# Altium schematic sheet bme_rfm95.SchDoc
size A4
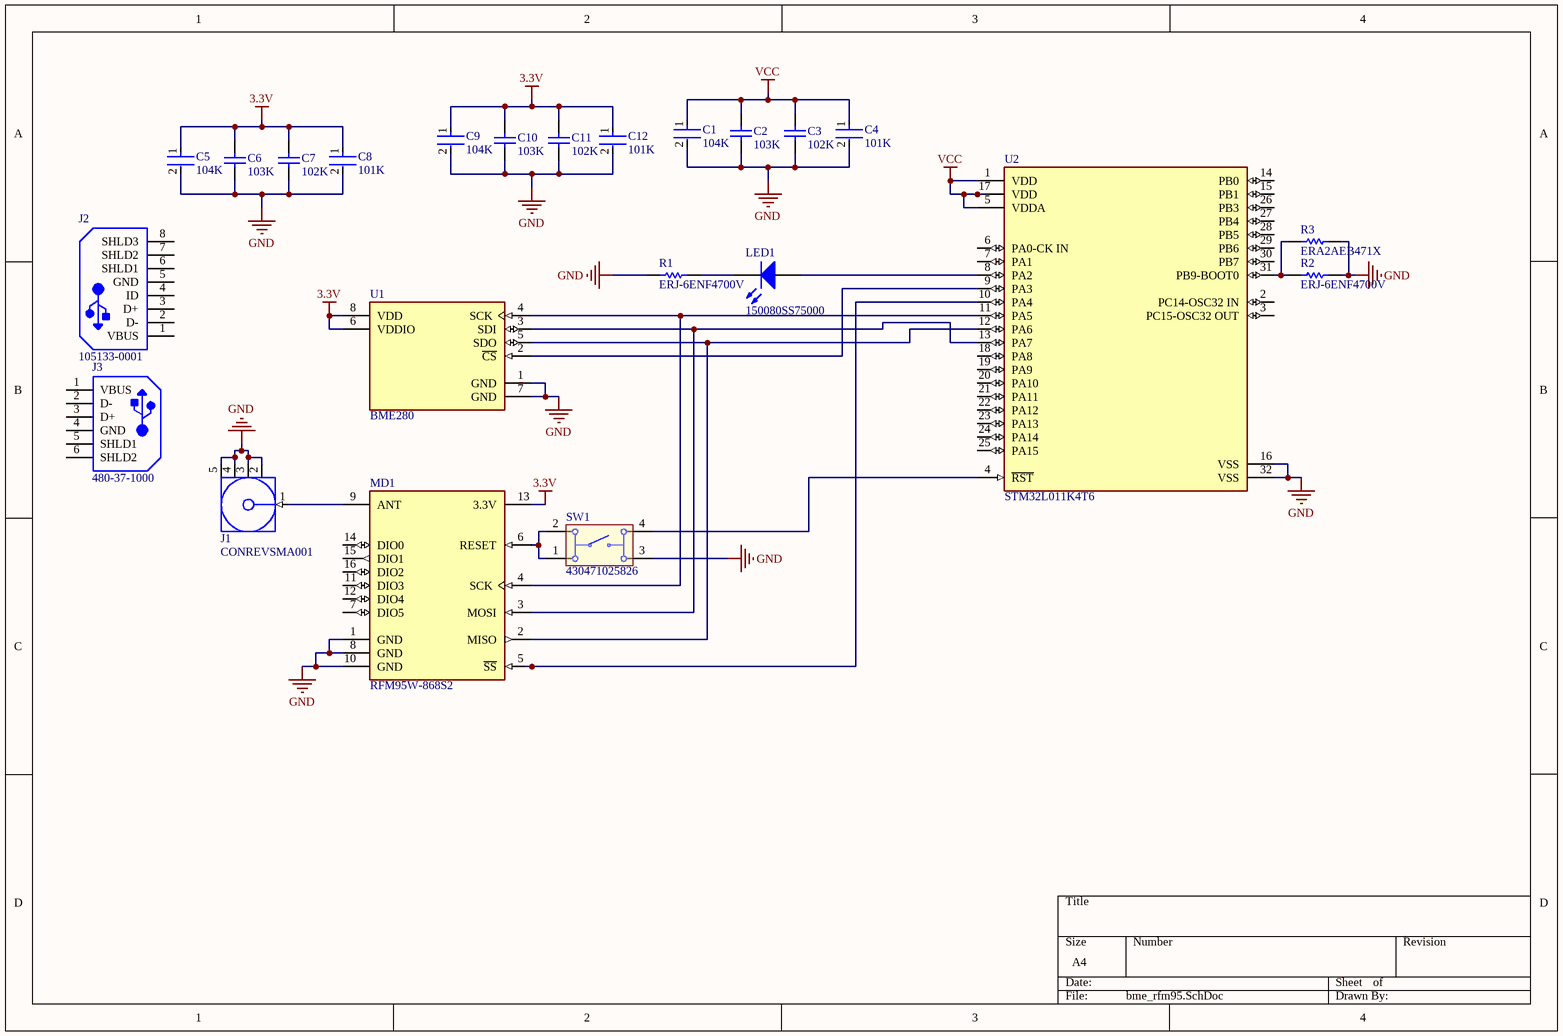
[diagram p0: bme_rfm95.SchDoc]

## Parts
C1  104K  [FP-C0805C-DN-MFG]
C2  103K  [CAPC2013X100X50NL20T25]
C3  102K  [CAPC2013X100X50LL20T25]
C4  101K  [FP-C0805C-DN-MFG]
C5  104K  [FP-C0805C-DN-MFG]
C6  103K  [CAPC2013X100X50NL20T25]
C7  102K  [CAPC2013X100X50LL20T25]
C8  101K  [FP-C0805C-DN-MFG]
C9  104K  [FP-C0805C-DN-MFG]
C10  103K  [CAPC2013X100X50NL20T25]
C11  102K  [CAPC2013X100X50LL20T25]
C12  101K  [FP-C0805C-DN-MFG]
J1  CONREVSMA001  [CON-REVSMA]
J2  105133-0001  [MOLX-105133-0001_V]
J3  480-37-1000  [MOLX-480-37-1000_V]
LED1  150080SS75000  [0805_A]
MD1  RFM95W-868S2  [FP-RFM95W-868S2-MFG]
R1  ERJ-6ENF4700V  [RESC2013X70X40LL20T20]
R2  ERJ-6ENF4700V  [RESC2013X70X40LL20T20]
R3  ERA2AEB471X  [RESC1005X40X25ML10T10]
SW1  430471025826  [430471025826]
U1  BME280  [FP-BME280-MFG]
U2  STM32L011K4T6  [FP-LQFP32-5V-MFG]

## Nets
3.3V: C5.1 C6.2 C7.2 C8.1 C9.1 C10.2 C11.2 C12.1 MD1.13(3.3V) U1.6(VDDIO) U1.8(VDD)
GND: C1.2 C2.1 C3.1 C4.2 C5.2 C6.1 C7.1 C8.2 C9.2 C10.1 C11.1 C12.2 J1.2(GND) J1.3(GND) J1.4(GND) J1.5(GND) MD1.1(GND) MD1.8(GND) MD1.10(GND) R1.1 R2.2 R3.2 SW1.3 U1.1(GND) U1.7(GND) U2.16(VSS) U2.32(VSS)
VCC: C1.1 C2.2 C3.2 C4.1 U2.1(VDD) U2.5(VDDA) U2.17(VDD)
NetJ1_1: J1.1(Signal) MD1.9(ANT)
NetLED1_1: LED1.1(K) R1.2
NetLED1_2: LED1.2(A) U2.8(PA2)
NetMD1_2: MD1.2(MISO) U1.5(SDO) U2.12(PA6)
NetMD1_3: MD1.3(MOSI) U1.3(SDI) U2.13(PA7)
NetMD1_4: MD1.4(SCK) U1.4(SCK) U2.11(PA5)
NetMD1_5: MD1.5(~{SS}) U2.10(PA4)
NetMD1_6: MD1.6(RESET) SW1.1 SW1.2
NetR2_1: R2.1 R3.1 U2.31(PB9-BOOT0)
NetSW1_4: SW1.4 U2.4(~{RST})
NetU1_2: U1.2(~{CS}) U2.9(PA3)

Not connected (* = marked no-connect by the designer): J2 1(VBUS) 2(D-) 3(D+) 4(ID) 5(GND) 6(SHLD1) 7(SHLD2) 8(SHLD3); J3 1(VBUS) 2(D-) 3(D+) 4(GND) 5(SHLD1) 6(SHLD2); MD1 7(DIO5) 11(DIO3) 12(DIO4) 14(DIO0) 15(DIO1) 16(DIO2); U2 2(PC14-OSC32_IN) 3(PC15-OSC32_OUT) 6(PA0-CK_IN) 7(PA1) 14(PB0) 15(PB1) 18(PA8) 19(PA9) 20(PA10) 21(PA11) 22(PA12) 23(PA13) 24(PA14) 25(PA15) 26(PB3) 27(PB4) 28(PB5) 29(PB6) 30(PB7)

## Library data of the parts
C1 C5 C9 = CMP-2007-00279-2: CAP CER 0.1UF 50V X7R 0805; Manufacturer Part Number: C0805C104K5RACTU; Manufacturer: KEMET; Value: 0.10 μF; Tolerance: 0.1; Temperature Coefficient: 30ppm/°C; Material: Ceramic; Device Class L2: Capacitors; Temperature Range Low: -55°C; Voltage Rating: 50 V; Digikey Description: CAP CER 0.1UF 50V X7R 0805; Category: Cap; ComponentLink2Description: Datasheet; Octopart: https://octopart.com/c0805c104k5ractu-kemet-143926; RoHS: TRUE; ComponentLink2URL: https://content.kemet.com/datasheets/KEM_C1003_C0G_SMD.pdf; Temperature Characteristic: X7R; Temperature: -55°C to +125°C; Height: 0.88mm; Temperature Range High: +125°C; Device Class L1: Passive Components; Automotive: No; Lead Free: Yes; Ipc Land Pattern Name: CAPC200125X78; Device Class L3: Ceramic Capacitors; Mouser Description: Cap Ceramic 0.1uF 50V X7R 10% SMD 2.0 x 1.2 mm 125 C Paper T/R; Capacitance: 0.10 μF; Package: C0805C-DN
C2 C6 C10 = CMP-2007-03708-1: Part Number: C0805F103K5RACTU; Manufacturer: Kemet
C3 C7 C11 = CMP-2007-03705-1: Manufacturer: Kemet; Part Number: C0805F102K1RACAUTO
C4 C8 C12 = CMP-03020-029683-1: C0805 100 pF X7R 30ppm/°C 10.00% 50 V; Manufacturer Part Number: C0805C101K5RAC; Manufacturer: KEMET; Voltage Rating: 50 V; Capacitance: 100 pF; Material: Ceramic; Value: 100 pF; Tolerance: 0.1; Device Class L2: Capacitors; Device Class L1: Passive Components; RoHS: TRUE; Lead Free: Yes; Temperature Range Low: -55°C; Device Class L3: Ceramic Capacitors; Automotive: No; Mouser Description: Cap Ceramic 100pF 50V X7R 10% Pad SMD 0805 125C Bulk; Temperature Coefficient: 30ppm/°C; Temperature Characteristic: X7R; Temperature Range High: +125°C; ComponentLink2URL: https://content.kemet.com/datasheets/KEM_C1003_C0G_SMD.pdf; Temperature: -55°C to +125°C; Height: 0.88mm; Octopart: https://octopart.com/c0805c101k5rac-kemet-9144005; ComponentLink2Description: Datasheet; Package: C0805C-DN; Category: Cap; Ipc Land Pattern Name: CAPC200125X78
J1 = CMP-0168-00008-1: RP-SMA Female PCB Mount Connector, Thru-Hole; DatasheetVersion: rev1.0, Mar-2005; PackageVersion: rev1.0, Mar-2005; PackageDescription: RP-SMA Female PCB Mount Connector, Thru-Hole, 7 x 7 mm Body; PackageReference: CON-REVSMA
J2 = CMP-2000-05829-1: Micro-USB B Receptacle, Vertical, -30 to 85 degC, 5-Pin SMD, RoHS, Tape and Reel; Manufacturer: Molex; Package Version: Rev. C, 11/2015; Voltage Rating: 30VAC; Connector Type: MicroUSBTypeBReceptacle; Current Rating: 1.8A; Number of Ports: 1; Voltage - Max: 30V; Mounting Style: SMD/SMT; Packaging: Reel; Product: MicroUSBTypeBConnectors; Contact Plating: Gold; Flammability Rating: UL94V-0; Package Description: 5-Pin Surface Mount Device, Pitch 0.65 mm; Package Reference: 105133-0001; Contact Material: CopperAlloy; Mounting Angle: Vertical; RoHS: Details; Manufacturer URL: http://www.molex.com/; Factory Pack Quantity: 6000; PartNumber: 105133-0001; Standard: USB; Brand: Molex; Series: 105133; Product Category: USBConnectors; Termination Style: SolderTail; Gender: Receptacle; Package URL: http://www.molex.com/pdm_docs/sd/1051330001_sd.pdf; Datasheet Version: 03/2016; Color: Black; Datasheet URL: http://www.molex.com/webdocs/datasheets/pdf/en-us/1051330001_IO_CONNECTORS.pdf; Mounting Technology: SurfaceMount
J3 = CMP-1676-00005-1: Universal Serial Bus (USB) Shielded I/O Plug, Type A, Right Angle Connector, 1.5 A, -20 to 85 degC, 4-Pin SMD, RoHS, Tray; Tolerance: 1%; Power Rating: 100 mW; Voltage Rating: 50 V; Case\Package: 0603; Resistance: 1 mohm; Width: 0.8 mm; Mount: Surface Mount; ComponentLink1URL: http://www.molex.com/; ComponentLink1Description: Manufacturer URL; REACH SVHC: No SVHC; Case Code (Imperial): 0603; Height: 0.45 mm; Max Operating Temperature: 155 degC; ComponentLink2Description: Datasheet; Min Operating Temperature: -55 degC; Length: 1.6 mm; Pins: 2; RoHSCompliant: true; Package Quantity: 5000; DatasheetVersion: Rev. D, 06/2004; PackageDescription: 4-Pin Surface Mount Device, Body 12 x 18.8 mm; Voltage Rating (DC): 50 V; PackageReference: 480-37-1000; Case Code (Metric): 1608; ComponentLink2URL: http://www.molex.com/pdm_docs/sd/480371000_sd.pdf; Packaging: Tape and Reel
LED1 = CMP-1426-00010-1: SMD mono-color Chip LED, WL-SMCW, Super Red; Manufacturer: Wuerth Elektronik; PackageReference: 0805_A; ComponentLink2URL: http://katalog.we-online.com/led/datasheet/150080SS75000.pdf; ComponentLink1URL: http://www.we-online.com; Color: Super Red; ComponentLink2Description: Datasheet; ComponentLink1Description: Manufacturer URL; PartNumber: 150080SS75000
MD1 = CMP-204316-000001-1: RX TXRX MODULE ISM < 1GHZ SMD; Data Rate: 300Kbps; Frequency: 868MHz; Sensitivity: -123dBm; Interface: SPI; Current - Transmitting: 120mA; Current - Receiving: 12.1mA; Max Operating Temperature: 70°C; Case/Package: SMD/SMT; Packaging: Bulk; Mount: Surface Mount; Min Operating Temperature: -20°C
R1 R2 = CMP-2001-00549-5: Chip Resistor, 470 Ohm, +/- 1%, 0.125 W, -55 to 155 degC, 0805 (2012 Metric), RoHS, Tape and Reel; Manufacturer: Panasonic; Voltage Rating: 150 V; ComponentLink1URL: http://www.panasonic.com/; ComponentLink2Description: Datasheet; RoHSCompliant: true; PackageDescription: 2-Pin Surface Mount Device, Body 2 x 1.25 mm; PackageReference: 0805; REACH SVHC: Yes; Max Operating Temperature: 155 degC; Mount: Surface Mount; Min Operating Temperature: -55 degC; DatasheetVersion: 04/2015; Mounting Technology: Surface Mount; Height: 0.6 mm; Package Quantity: 1; ComponentLink2URL: http://industrial.panasonic.com/cdbs/www-data/pdf/RDA0000/AOA0000C86.pdf; Length: 2 mm; ComponentLink1Description: Manufacturer URL; Pins: 2; Packaging: Cut Tape
R3 = CMP-2002-05887-1: Manufacturer: Panasonic; Part Number: ERA2AEB471X
SW1 = CMP-1452-00022-1: WS-TASV SMD Tact Switch 6X6 mm; Manufacturer: Wuerth Elektronik; NoPins: 04; ComponentLink1Description: Manufacturer URL; PackageReference: 430471025826; ComponentLink2Description: Datasheet; ComponentLink2URL: http://katalog.we-online.de/em/datasheet/4304x1.pdf; ComponentLink1URL: http://www.we-online.com; PartNumber: 430471025826
U1 = CMP-2000-05073-3: SENSOR PRESSURE HUMIDITY TEMP; Sensor Type: Temperature; Accuracy: 3%; Response Time: 1s; Output Type: SPI; Min Operating Temperature: -40°C; Max Operating Temperature: 85°C; Case/Package: LGA; Packaging: Cut Tape; Mount: Surface Mount; Lead Free: Lead Free; Number of Pins: 8
U2 = CMP-12105-000012-1: IC MCU 32BIT 16KB FLASH 32LQFP; Manufacturer: STMicroelectronics; Number Of Adc Channels: 10; Min Supply Voltage: 1.65V; Number Of I2C Channels: 1; Data Bus Width: 32bits; Number Of Timers/Counters: 8; Standoff Height: 0.05mm; Memory Size: 16KBytes; Max Junction Temp: +105°C; Number Of I/Os: 26; Number Of Uart Channels: 2; Interface: I2C,SPI,UART,USART,IrDA; Ram Size: 2KBytes; Frequency: 32MHz; Nominal Supply Current: 500-1500uA; Max Supply Voltage: 3.6V; Core Architecture: Arm Cortex-M0+; Temperature Range Low: -40°C; Package: LQFP32-5V; Lead Free: Yes; Number Of Spi Channels: 1; Number Of A/D Converters: 1; Manufacturer Part Number: STM32L011K4T6; Ambient Temperature Range Low: -40°C; Automotive: No; Category: IC; ComponentLink2URL: https://www.st.com/content/ccc/resource/technical/document/datasheet/42/c0/ab/e5/71/7a/47/0b/DM00206508.pdf/files/DM00206508.pdf/jcr:content/translations/en.DM00206508.pdf; Device Class L3: Microcontrollers; Mouser Description: ARM Microcontrollers - MCU Ultra-low-power ARM Cortex-M0+ MCU with 16-Kbytes Flash, 32 MHz CPU; Number Of Cores: 1; Device Class L2: Embedded Processors and Controllers; Height: 1.6mm; Memory Type: FLASH; Device Class L1: Integrated Circuits (ICs); Digikey Description: IC MCU 32BIT 16KB FLASH 32LQFP; RoHS: TRUE; Ipc Land Pattern Name: QFP80P900X900X160-32; Ambient Temperature Range High: +85°C; Temperature Range High: +85°C; Octopart: https://octopart.com/stm32l011k4t6-stmicroelectronics-71108062; ComponentLink2Description: Datasheet; Temperature: -40°C to +85°C